# Altium schematic sheet INT_REG.SchDoc
size A4; SheetNumber: 4; SheetTotal: 9
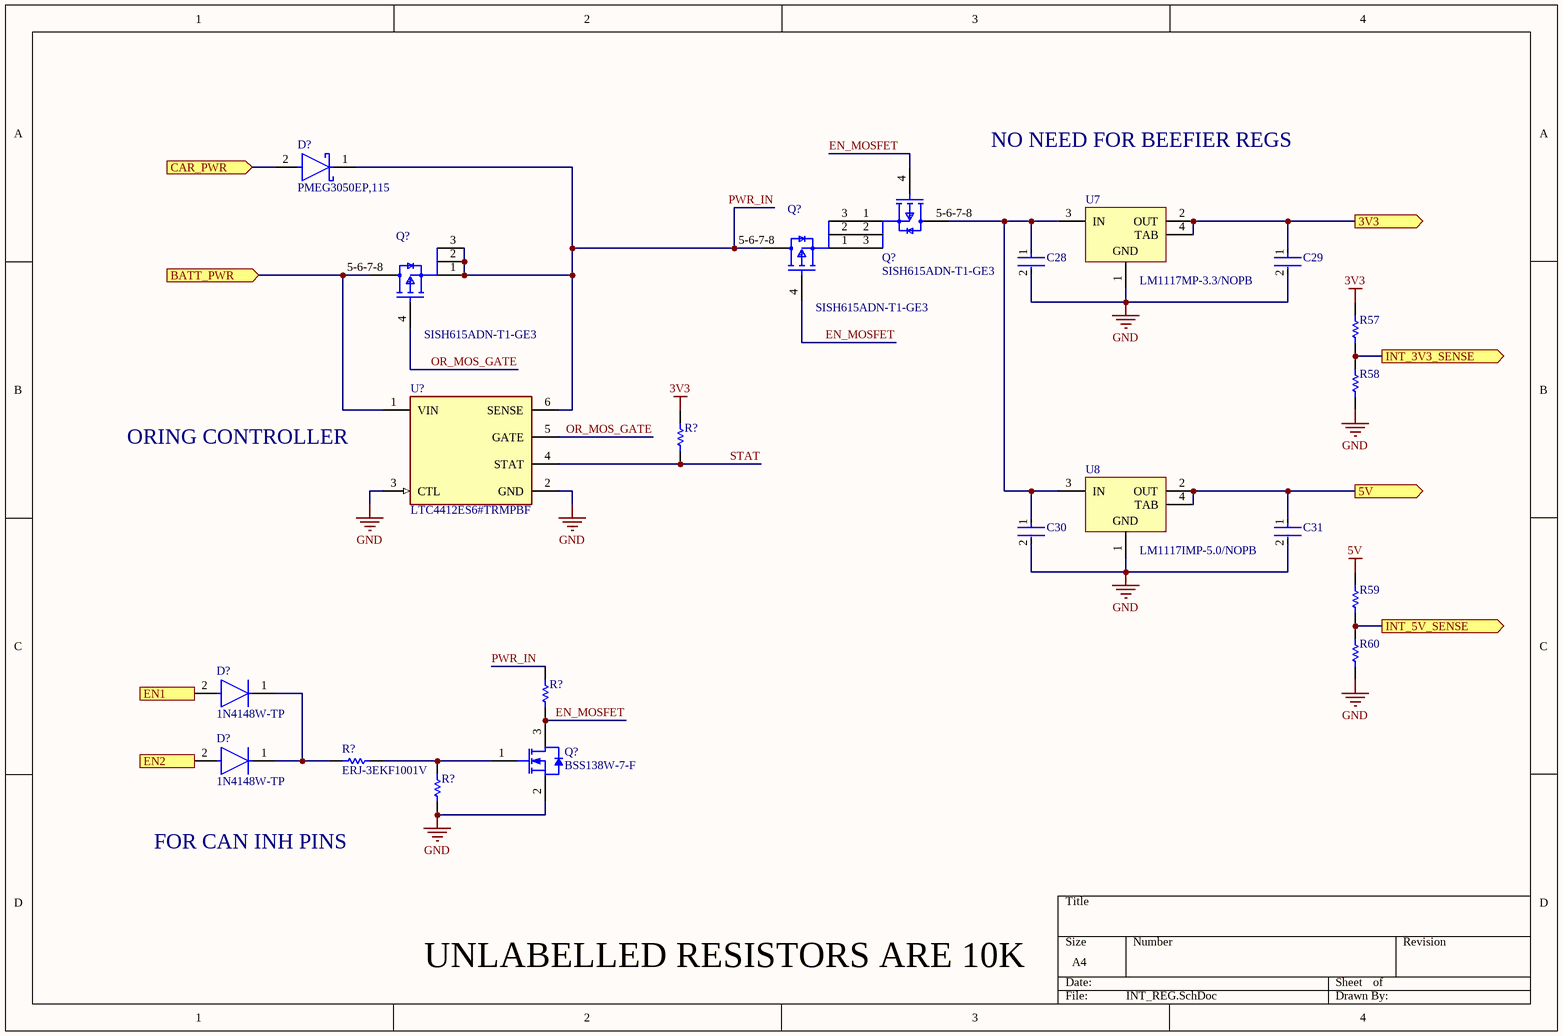
[diagram p0: INT_REG.SchDoc]

## Parts
(Parts that share a designator on the sheet are numbered #1, #2 ... from top to bottom, then left to right.)
C28  GRM188R61E106KA73D  [FP-GRM188-0_2-IPC_A]  (value not drawn)
C29  GRM188R61E106KA73D  [FP-GRM188-0_2-IPC_A]  (value not drawn)
C30  GRM188R61E106KA73D  [FP-GRM188-0_2-IPC_A]  (value not drawn)
C31  GRM188R61E106KA73D  [FP-GRM188-0_2-IPC_A]  (value not drawn)
D?#1  PMEG3050EP,115  [FP-SOD128-MFG]
D?#2  1N4148W-TP  [FP-SOD-123-IPC_A]
D?#3  1N4148W-TP  [FP-SOD-123-IPC_A]
Q?#1  SISH615ADN-T1-GE3  [SISH615ADN-T1-GE3-Footprint-1]
Q?#2  SISH615ADN-T1-GE3  [SISH615ADN-T1-GE3-Footprint-1]
Q?#3  SISH615ADN-T1-GE3  [SISH615ADN-T1-GE3-Footprint-1]
Q?#4  BSS138W-7-F  [DIOD-SOT323-3_V]
R57  ERJ3EKF1002V  [RESC1609X55X30LL15T15]  (value not drawn)
R58  ERJ3EKF1002V  [RESC1609X55X30LL15T15]  (value not drawn)
R59  ERJ3EKF1002V  [RESC1609X55X30LL15T15]  (value not drawn)
R60  ERJ3EKF1002V  [RESC1609X55X30LL15T15]  (value not drawn)
R?#1  ERJ3EKF1002V  [RESC1609X55X30LL15T15]  (value not drawn)
R?#2  ERJ3EKF1002V  [RESC1609X55X30LL15T15]  (value not drawn)
R?#3  ERJ-3EKF1001V  [RESC1608X55X30LL15T15]
R?#4  ERJ3EKF1002V  [RESC1609X55X30LL15T15]  (value not drawn)
U7  LM1117MP-3.3/NOPB  [DCY0004A_L]
U8  LM1117IMP-5.0/NOPB  [DCY0004A_M]
U?  LTC4412ES6#TRMPBF  [FP-S6-6-05-08-1636-IPC_C]

## Ports
3V3 (out, see BRZ_BATT_MGR[3A]), 5V (out, see BRZ_BATT_MGR[3A]), BATT_PWR (in, see BRZ_BATT_MGR[2A]), CAR_PWR (in, see BRZ_BATT_MGR[2A]), EN1 (in, see BRZ_BATT_MGR[2A]), EN2 (in, see BRZ_BATT_MGR[2A]), INT_3V3_SENSE (out, see BRZ_BATT_MGR[3A], STM32H730_PINOUT[7A]), INT_5V_SENSE (out, see BRZ_BATT_MGR[3A], STM32H730_PINOUT[7A])

## Nets
3V3: R57.2 R?#1.1
5V: R59.2
GND: C28.2 C29.2 C30.2 C31.2 Q?#4.2(S) R58.1 R60.2 R?#4.1 U7.1(GND) U8.1(GND) U?.2(GND) U?.3(CTL)
3V3: C29.1 U7.2(OUT) U7.4(TAB) ; port 3V3  [a separate net that carries the same name]
5V: C31.1 U8.2(OUT) U8.4(TAB) ; port 5V  [a separate net that carries the same name]
BATT_PWR: Q?#3.5-6-7-8(D) U?.1(VIN) ; port BATT_PWR
CAR_PWR: D?#1.2(A) ; port CAR_PWR
EN1: D?#2.2(A) ; port EN1
EN2: D?#3.2(A) ; port EN2
EN_MOSFET: Q?#1.4(G) Q?#2.4(G) Q?#4.3(D) R?#2.1
INT_3V3_SENSE: R57.1 R58.2 ; port INT_3V3_SENSE
INT_5V_SENSE: R59.1 R60.1 ; port INT_5V_SENSE
OR_MOS_GATE: Q?#3.4(G) U?.5(GATE)
PWR_IN: D?#1.1(C) Q?#2.5-6-7-8(D) Q?#3.1(S) Q?#3.2(S) Q?#3.3(S) R?#2.2 U?.6(SENSE)
STAT: R?#1.2 U?.4(STAT)
NetC28_1: C28.1 C30.1 Q?#1.5-6-7-8(D) U7.3(IN) U8.3(IN)
NetD?#2_1: D?#2.1(C) D?#3.1(C) R?#3.2
NetQ?#1_1: Q?#1.1(S) Q?#2.3(S)
NetQ?#1_2: Q?#1.2(S) Q?#2.2(S)
NetQ?#1_3: Q?#1.3(S) Q?#2.1(S)
NetQ?#4_1: Q?#4.1(G) R?#3.1 R?#4.2

## Notes on the sheet
- NO NEED FOR BEEFIER REGS
- ORING CONTROLLER
- FOR CAN INH PINS
- UNLABELLED RESISTORS ARE 10K

## Library data of the parts
C28-C31 = CMP-06035-045268-1: Chip Multilayer Ceramic Capacitors for General Purpose, 0603, 10uF, X5R, 15%, 10%, 25V; Case/Package: 0603
D?#1 = CMP-14398-000051-1: DIODE SCHOTTKY 30V 5A SOD128; RoHS Compliant: Yes
D?#2 D?#3 = CMP-2000-04993-2: DIODE GEN PURP 100V 150MA SOD123; Max Reverse Leakage Current: 5uA; Max Surge Current: 2A; Reverse Recovery Time: 4ns; Polarity: Standard; Capacitance: 4pF; Max Forward Surge Current (Ifsm): 1A; Element Configuration: Single; Power Dissipation: 400mW; Forward Voltage: 1V; Radiation Hardening: No; Lead Free: Lead Free; Max Reverse Voltage (DC): 100V; Current Rating: 150mA; Forward Current: 150mA; Packaging: Tape and Reel; Number of Pins: 2; Package Quantity: 3000; Max Operating Temperature: 150°C; Min Operating Temperature: -65°C; Average Rectified Current: 150mA; Recovery Time: 4ns; Output Current: 150mA; Peak Non-Repetitive Surge Current: 2A; Width: 1.8mm; Voltage Rating (DC): 100V; Height: 1.2mm; Max Repetitive Reverse Voltage (Vrrm): 100V; Mount: Surface Mount; Length: 2.85mm
Q?#1-Q?#3 = CMP-013-00036-1: Trans MOSFET P-CH 20V 22.1A 8-Pin PowerPAK 1212 EP T/R
Q?#4 = CMP-2000-05968-1: N-Channel Enhancement Mode Mosfet, 50 V, 200 mA, -55 to 150 degC, 6-Pin SOT-323, RoHS, Tape and Reel; Typical Turn-Off Delay Time: 20ns; Number of Channels: 1Channel; Type: EnhancementModeFieldEffectTransistor; Brand: DiodesIncorporated; Vds - Drain-Source Breakdown Voltage: 75V; Vgs - Gate-Source Voltage: 20V; Rds On - Drain-Source Resistance: 1.4Ohms; Transistor Type: 1N-Channel; Configuration: Single; Unit Weight: 0.000212oz; Pd - Power Dissipation: 200mW; Id - Continuous Drain Current: 200mA; Forward Transconductance - Min: 0.1S; Manufacturer URL: http://www.diodes.com/; Series: BSS138; Package Description: 3-Pin Small Outline Transistor, Body 2 x 1.25 mm, Pitch 0.65 mm; Mounting Technology: SurfaceMount; Product Category: MOSFET; RoHS: True; Maximum Operating Temperature: +150C; Height: 1mm; Length: 2.2mm; Technology: Si; Width: 1.35mm; Datasheet URL: http://www.diodes.com/_files/datasheets/ds30206.pdf; Manufacturer: DiodesIncorporated; Package / Case: SOT-323-3; Typical Turn-On Delay Time: 20ns; Transistor Polarity: N-Channel; Factory Pack Quantity: 3000; Packaging: Reel; Product: MOSFETSmallSignal; Datasheet Version: Rev. 11-2, 09/2013; Package Reference: SOT323; Minimum Operating Temperature: -55C; Mounting Style: SMD/SMT; Channel Mode: Enhancement
R57-R60 R?#1 R?#2 R?#4 = CMP-1012-00623-3: Chip Resistor, 10 KOhm, +/- 1%, 0.1 W, -55 to 155 degC, 0603 (1608 Metric), RoHS, Tape and Reel; Manufacturer: Panasonic; Voltage Rating: 75V; Case\/Package: 0603; Power Rating: 100mW; Resistance: 10KOhm; Temperature Coefficient: 100ppm\/degreesC; Number of Pins: 2; Package Reference: 603; Depth: 0.8mm; Mount: SurfaceMount; Package Description: 2-Pin Surface Mount Device, Body 1.6 x 0.85 mm; Datasheet Version: 02/2017; Length: 1.6mm; Lead Free: LeadFree; Height: 0.45mm; Number of Terminations: 2; Max Power Dissipation: 100mW; Min Operating Temperature: -55degC; Datasheet URL: https://industrial.panasonic.com/cdbs/www-data/pdf/RDA0000/AOA0000C304.pdf; Termination: SMD/SMT; Case Code (Metric): 1608; Case Code (Imperial): 0603; Tolerance: 1%; Max Operating Temperature: 155degC; RoHSCompliant: true; Voltage Rating (DC): 75V; Radiation Hardening: No; Packaging: TapeandReel; Composition: ThickFilm; Mounting Technology: SurfaceMount; Manufacturer URL: http://www.panasonic.com/; Width: 0.031inch; REACH SVHC: NoSVHC; Contact Plating: Tin; Military Standard: Not; Package Quantity: 1
R?#3 = CMP-2000-00180-1: Manufacturer: Panasonic; Part Number: ERJ-3EKF1001V
U7 = CMP-0062-01638-4: 800mA Low-Dropout Linear Regulator, 4-pin SOT-223, Pb-Free; Manufacturer: Texas Instruments; CompType: LDO IC; PackageTopMarking: XYTT*N05A; High-Reliability: Y; PowerWise: N; ComponentLink1URL: http://www.ti.com/general/docs/lit/getliterature.tsp?genericPartNumber=LM1117-N&fileType=pdf; PinCount: 4; PackageDescription: Molded SOT-223, 6.50 x 3.56 x 1.6mm Body, 4 Lead, 2.3mm Pitch; Code_IPC: SOT223-4; PartNumber: LM1117MP-3.3/NOPB; Code_JEDEC: TO-261-AA; RoHS: Y; PackageReference: DCY0004A; ComponentLink1Description: Datasheet URL
U8 = CMP-0062-01627-4: 800mA Low-Dropout Linear Regulator, 4-pin SOT-223, Pb-Free; Manufacturer: Texas Instruments; PackageTopMarking: XYTT*N06B; CompType: LDO IC; PowerWise: N; High-Reliability: Y; RoHS: Y; Code_JEDEC: TO-261-AA; ComponentLink1URL: http://www.ti.com/general/docs/lit/getliterature.tsp?genericPartNumber=LM1117-N&fileType=pdf; Code_IPC: SOT223-4; ComponentLink1Description: Datasheet URL; PartNumber: LM1117IMP-5.0/NOPB; PackageReference: DCY0004A; PinCount: 4; PackageDescription: Molded SOT-223, 6.50 x 3.56 x 1.6mm Body, 4 Lead, 2.3mm Pitch
U? = CMP-0479-00425-2: IC OR CTRLR SRC SELECT TSOT23-6; Min Supply Voltage: 2.5V; Max Supply Voltage: 28V; Turn-On Delay Time: 110us; Number of Channels: 1; Lead Free: Lead Free; Length: 2.9mm; Radiation Hardening: No; RoHS Compliant: Yes; Package Quantity: 1; Min Operating Temperature: -40°C; Series: PowerPath™; Packaging: Tape and Reel; Width: 1.75mm; Height: 0.9mm; Number of Pins: 6; Max Operating Temperature: 85°C; Number of Outputs: 1; Case/Package: TSOT; REACH SVHC: No SVHC